# EAGLE schematic filter (EAGLE 7.1.0)
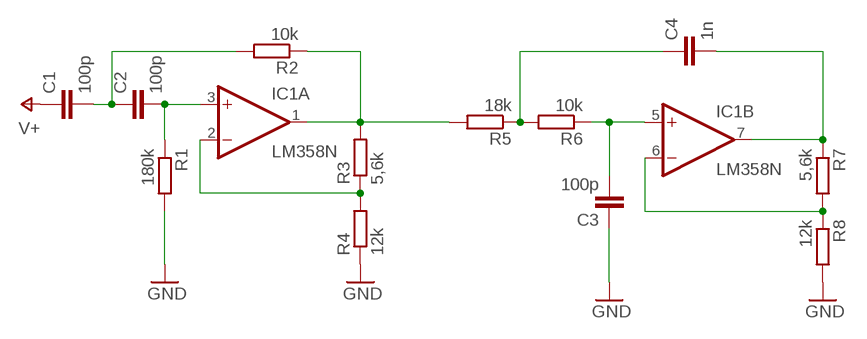
[diagram p0: schematic, sheet 1]

## Parts
C1  100p  C-EU050-024X044  [C050-024X044]
C2  100p  C-EU050-024X044  [C050-024X044]
C3  100p  C-EU050-024X044  [C050-024X044]
C4  1n  C-EU050-024X044  [C050-024X044]
IC1  LM358N  [DIL08]
R1  180k  R-EU_0207/10  [0207/10]
R2  10k  R-EU_0207/10  [0207/10]
R3  5,6k  R-EU_0207/10  [0207/10]
R4  12k  R-EU_0207/10  [0207/10]
R5  18k  R-EU_0207/10  [0207/10]
R6  10k  R-EU_0207/10  [0207/10]
R7  5,6k  R-EU_0207/10  [0207/10]
R8  12k  R-EU_0207/10  [0207/10]

## Nets
GND: C3.1 R1.2 R4.1 R8.2
N$1: IC1.1(A:OUT) R2.1 R3.2 R5.2
N$2: IC1.2(A:-IN) R3.1 R4.2
N$3: C2.2 IC1.3(A:+IN) R1.1
N$4: C1.2 C2.1 R2.2
N$5: C4.1 R5.1 R6.2
N$6: C3.2 IC1.5(B:+IN) R6.1
N$7: IC1.6(B:-IN) R7.2 R8.1
N$8: C4.2 IC1.7(B:OUT) R7.1
V+: C1.1

## Power pins joined to a net without a drawn wire
V+: IC1.8(P:V+)
V-: IC1.4(P:V-)

## Library data of the parts
C1-C4 = rcl:C-EU: CAPACITOR, European symbol
IC1 = linear:LM358: OP AMP also LM158; LM258; LM2904 Source: http://cache.national.com/ds/LM/LM158.pdf
R1-R8 = rcl:R-EU_: RESISTOR, European symbol